# EAGLE design TC1014 (EAGLE 7.1.0)
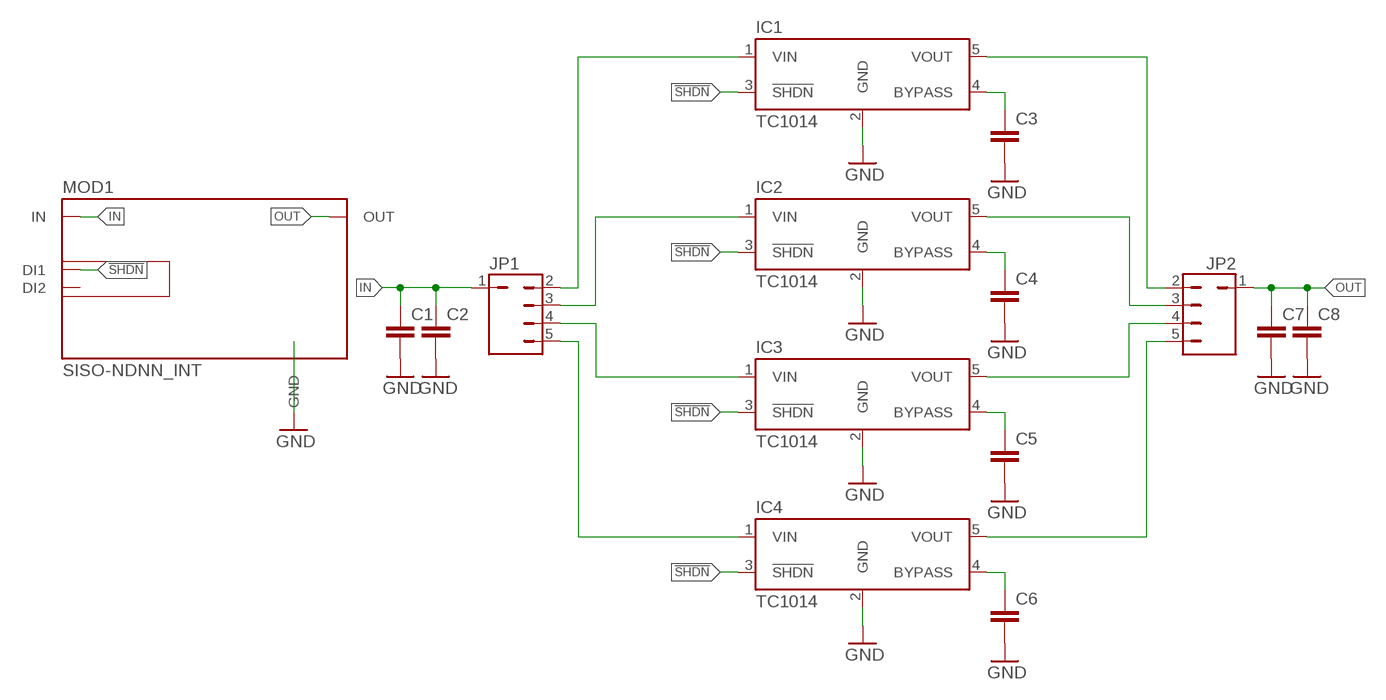
[diagram p0: schematic, sheet 1]

## Parts
C1  C-EUC0805  [C0805]
C2  C-EUC0805  [C0805]
C3  C-EUC0805  [C0805]
C4  C-EUC0805  [C0805]
C5  C-EUC0805  [C0805]
C6  C-EUC0805  [C0805]
C7  C-EUC0805  [C0805]
C8  C-EUC0805  [C0805]
IC1  TC1014  [SOT23-5]
IC2  TC1014  [SOT23-5]
IC3  TC1014  [SOT23-5]
IC4  TC1014  [SOT23-5]
JP1  JP4Q  [JP1-4]
JP2  JP4Q  [JP1-4]
MOD1  SISO-NDNN_INT  [SISO-NDNN]

## Nets
!SHDN: IC1.3(!SHDN) IC2.3(!SHDN) IC3.3(!SHDN) IC4.3(!SHDN) MOD1.DI1
GND: C1.2 C2.2 C3.2 C4.2 C5.2 C6.2 C7.2 C8.2 IC1.2(GND) IC2.2(GND) IC3.2(GND) IC4.2(GND) MOD1.GND1(GND) MOD1.GND2(GND) MOD1.GND3(GND) MOD1.GND4(GND)
IN: C1.1 C2.1 JP1.1 MOD1.IN1(IN) MOD1.IN2(IN) MOD1.IN3(IN) MOD1.IN4(IN)
N$1: IC1.1(VIN) JP1.2
N$2: IC2.1(VIN) JP1.3
N$3: IC3.1(VIN) JP1.4
N$4: IC4.1(VIN) JP1.5
N$5: IC1.5(VOUT) JP2.2
N$6: IC2.5(VOUT) JP2.3
N$7: IC3.5(VOUT) JP2.4
N$8: IC4.5(VOUT) JP2.5
N$10: C3.1 IC1.4(BYPASS)
N$11: C4.1 IC2.4(BYPASS)
N$12: C5.1 IC3.4(BYPASS)
N$13: C6.1 IC4.4(BYPASS)
OUT: C7.1 C8.1 JP2.1 MOD1.OUT1(OUT) MOD1.OUT2(OUT) MOD1.OUT3(OUT) MOD1.OUT4(OUT)
Unconnected: MOD1.DI2

## Library data of the parts
C1-C8 = rcl:C-EU: CAPACITOR, European symbol
IC1-IC4 = TC1014:TC1014
JP1 JP2 = Jumper_mod:JP4Q: JUMPER
MOD1 = AllModules:SISO-NDNN_INT

## Board
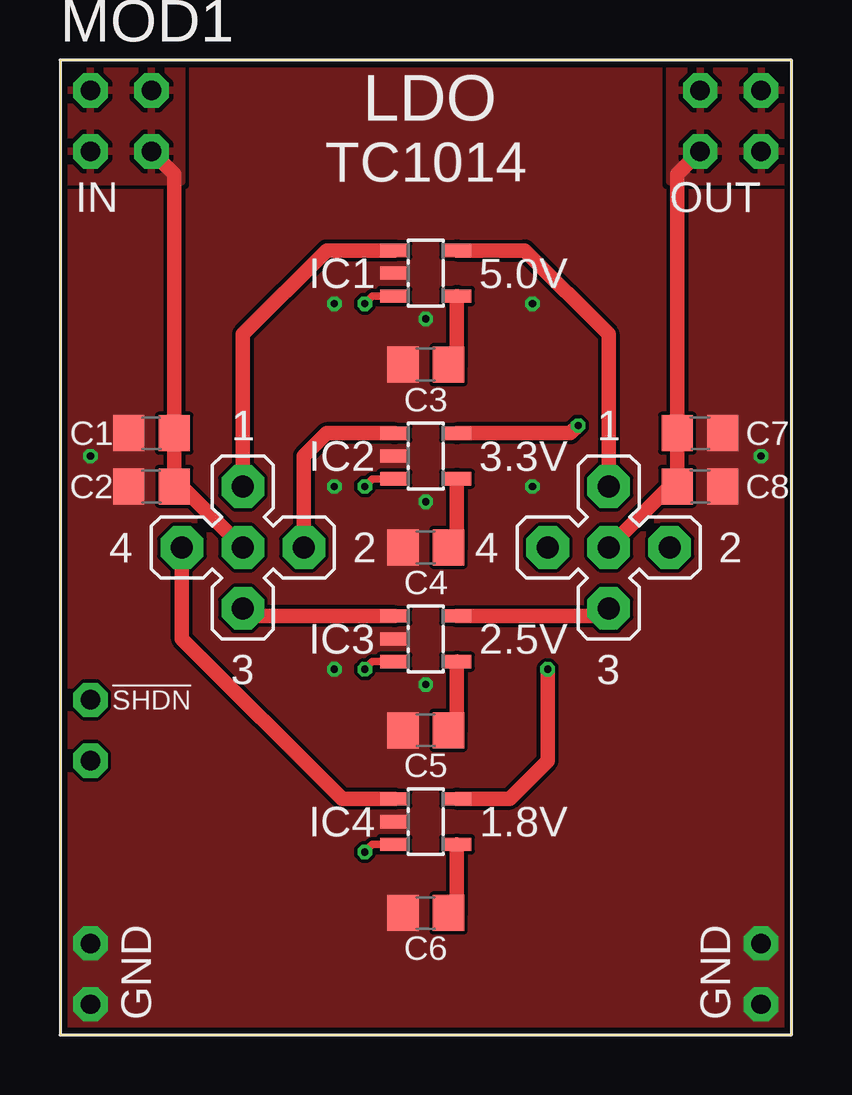
[diagram p1: board, top side]
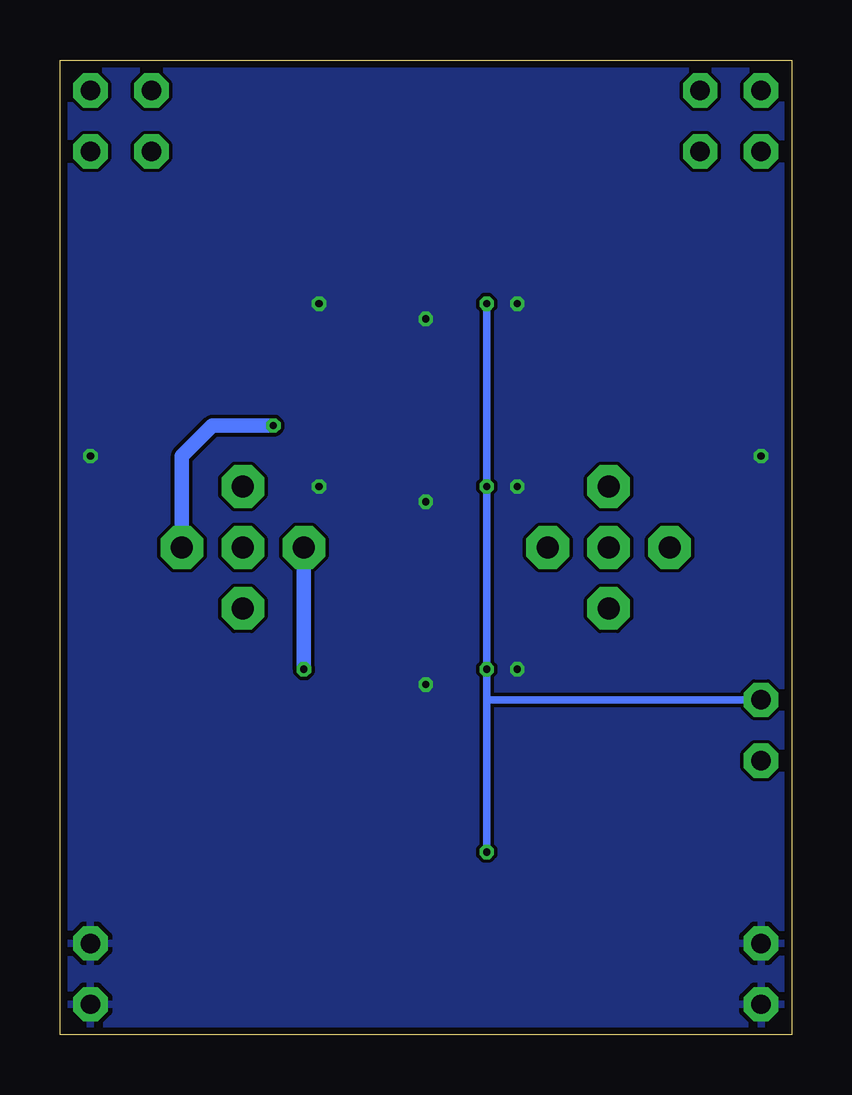
[diagram p2: board, bottom side, seen from below]

Size 30.48 x 40.64 mm. Coordinates in mm from the lower left corner, seen from the top.
Outline: 0,0 30.48,0 30.48,40.64 0,40.64 0,0
Copper layers (1*16): Top 0.035mm / dielectric 1.5mm / Bottom 0.035mm
Design rules "PCB-POOL Standard": minimum track width 0.15mm, minimum drill 0.3mm, track to track 0.15mm, track to pad 0.15mm, pad to pad 0.15mm, via to via 0.15mm, smd to smd 0.15mm, copper to edge 0.3mm, drill to drill 0.2mm, minimum pad ring 0.2mm, minimum via ring 0.15mm, stop-mask expansion 0.075mm, vias tented up to drill 0mil, thermal gap 0.2mm

### Footprints (pad centres in the part's own frame; a part is rotated, then mirrored left to right if it is on the bottom)
C0805 = smd 1.3 x 1.5: 1 -0.95,0; 2 0.95,0
SOT23-5 = smd 0.55 x 1.2: 1 -0.95,-1.3; 2 0,-1.3; 3 0.95,-1.3; 4 0.95,1.3; 5 -0.95,1.3
JP1-4 = drill 0.914 pad 1.778 octagon: 1 0,0; 2 0,2.54; 3 2.54,0; 4 0,-2.54; 5 -2.54,0
SISO-NDNN = drill 0.8 pad 1.422 octagon: DI1 0,-25.4; DI2 0,-27.94; GND1 0,-38.1; GND2 0,-35.56; GND3 27.94,-35.56; GND4 27.94,-38.1; IN1 0,0; IN2 0,-2.54; IN3 2.54,0; IN4 2.54,-2.54; OUT1 25.4,0; OUT2 25.4,-2.54; OUT3 27.94,0; OUT4 27.94,-2.54

### Placement (x,y rotation side)
C1  3.81,25.08 180 top
C2  3.81,22.86 180 top
C3  15.24,27.94 180 top
C4  15.24,20.32 180 top
C5  15.24,12.7 180 top
C6  15.24,5.08 180 top
C7  26.67,25.08 0 top
C8  26.67,22.86 0 top
IC1  15.24,31.75 270 top
IC2  15.24,24.13 270 top
IC3  15.24,16.51 270 top
IC4  15.24,8.89 270 top
JP1  7.62,20.32 0 top
JP2  22.86,20.32 0 top
MOD1  1.27,39.37 0 top

### Tracks (layer width: path | path; a pad name or v marks a point on that pad's centre or on a via)
!SHDN  (via drill 0.3)
  Top 0.305: IC1.3 13.02,30.8 v12.7,30.48 | IC2.3 13.02,23.18 v12.7,22.86 | IC3.3 13.02,15.56 v12.7,15.24 | IC4.3 13.02,7.94 v12.7,7.62
  Bottom 0.305: v12.7,30.48 v12.7,22.86 v12.7,15.24 12.7,13.97 | 12.7,13.97 v12.7,7.62 | MOD1.DI1 12.7,13.97
GND  (via drill 0.3)
  other vias: 15.24,29.84 15.24,22.23 15.24,14.61 11.43,15.24 11.43,22.86 11.43,30.48 19.68,30.48 19.68,22.86 1.27,24.13 29.21,24.13
  pour Bottom (rank 2): -5.08,45.72 35.56,45.72 35.56,-5.08 -5.08,-5.08
  pour Top (rank 2, no thermals): -2.54,43.18 33.02,43.18 33.02,-2.54 -2.54,-2.54
IN
  Top 0.61: MOD1.IN4 4.76,35.88 C1.1 C2.1 5.08,22.86 JP1.1
  pour Top: 0,40.64 5.08,40.64 5.08,35.56 0,35.56
N$1
  Top 0.61: IC1.1 11.11,32.7 7.62,29.21 JP1.2
N$2
  Top 0.61: IC2.1 11.11,25.08 10.16,24.13 JP1.3
N$3
  Top 0.61: IC3.1 7.94,17.46 JP1.4
N$4
  Top 0.61: IC4.1 11.75,9.84 5.08,16.51 JP1.5
N$5
  Top 0.61: IC1.5 19.37,32.7 22.86,29.21 JP2.2
N$6  (via drill 0.3)
  Top 0.61: v21.59,25.4 21.27,25.08 IC2.5
  Bottom 0.61: JP2.3 25.4,24.13 24.13,25.4 v21.59,25.4
N$7
  Top 0.61: IC3.5 22.54,17.46 JP2.4
N$8  (via drill 0.3)
  Top 0.61: IC4.5 18.73,9.84 20.32,11.43 v20.32,15.24
  Bottom 0.61: v20.32,15.24 JP2.5
N$10
  Top 0.61: IC1.4 16.54,27.94 C3.1
N$11
  Top 0.61: IC2.4 16.54,20.32 C4.1
N$12
  Top 0.61: IC3.4 16.54,12.7 C5.1
N$13
  Top 0.61: IC4.4 16.54,5.08 C6.1
OUT
  Top 0.61: MOD1.OUT2 25.72,35.88 C7.1 C8.1 25.4,22.86 JP2.1
  pour Top: 25.4,40.64 30.48,40.64 30.48,35.56 25.4,35.56

### Text on the board
tNames: LDO | TC1014 | 5.0V | 1 | 1 | 3.3V | 4 | 2 | 4 | 2 | 2.5V | 3 | 3 | !SHDN | 1.8V
bStop: Beckedahl & Kokert / 15.09.2016